# EAGLE board 0.1 (EAGLE 9.2.2), part 1 of 2
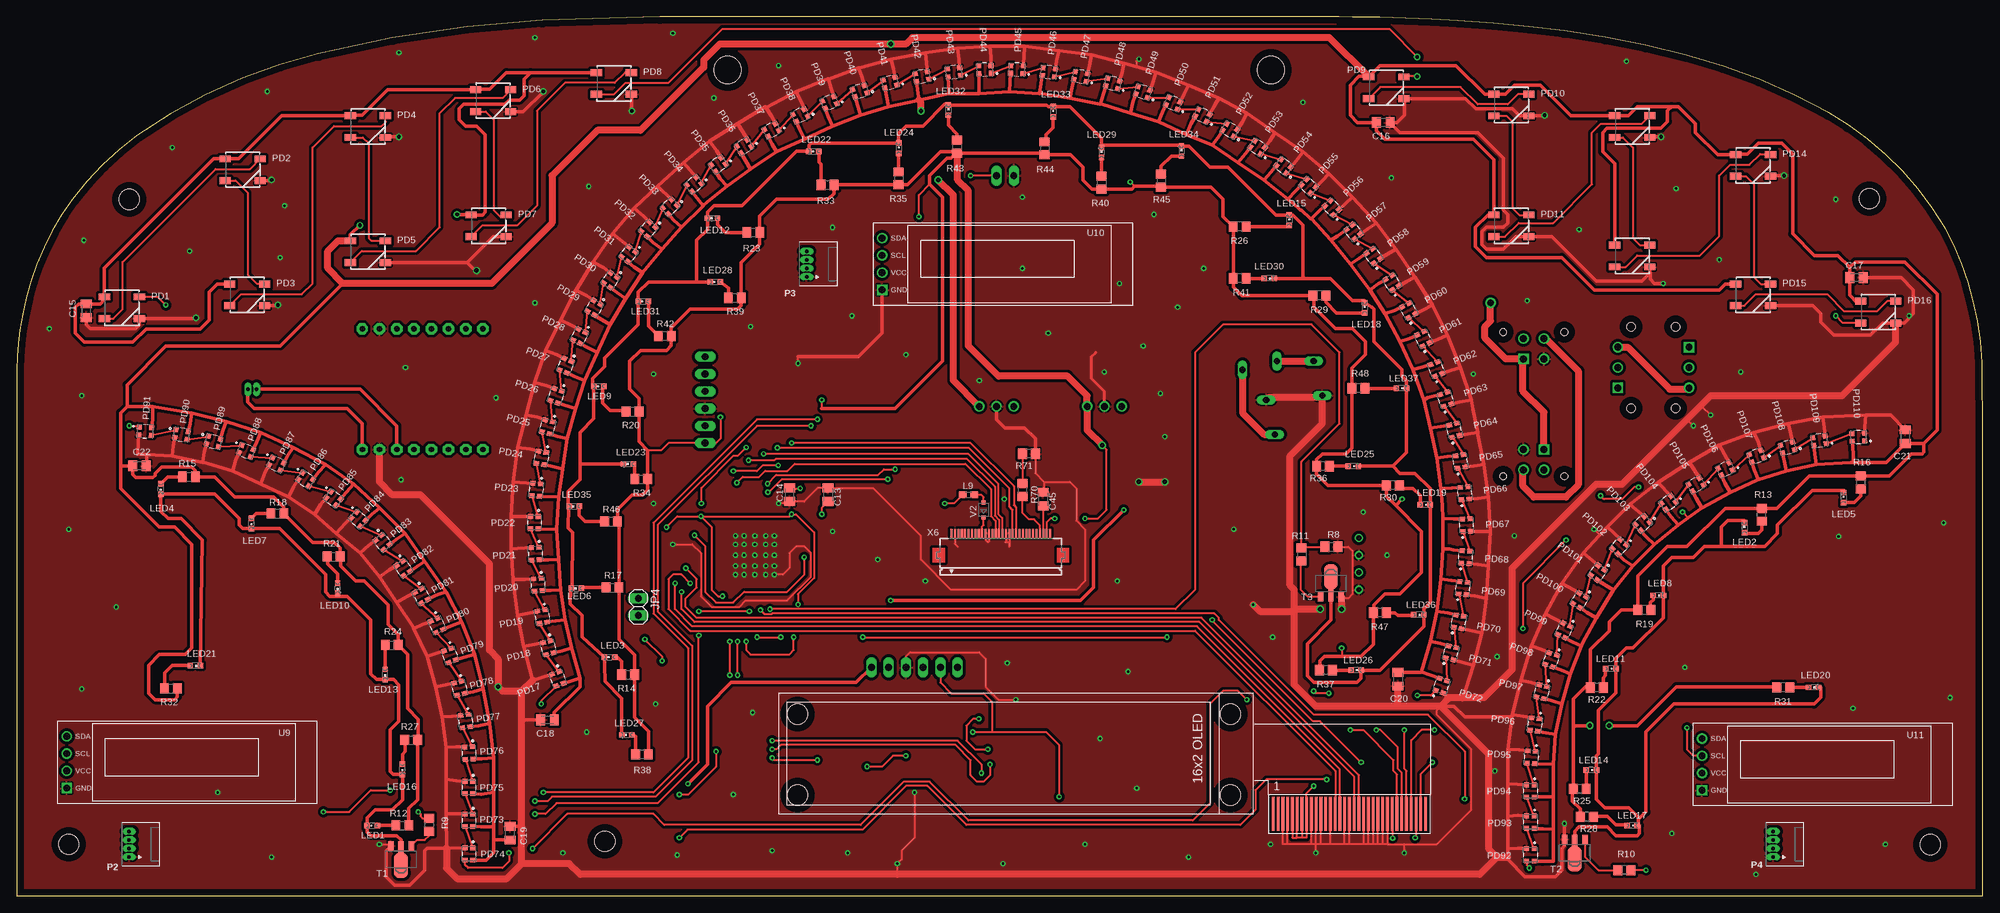
[diagram p9: board, top side]
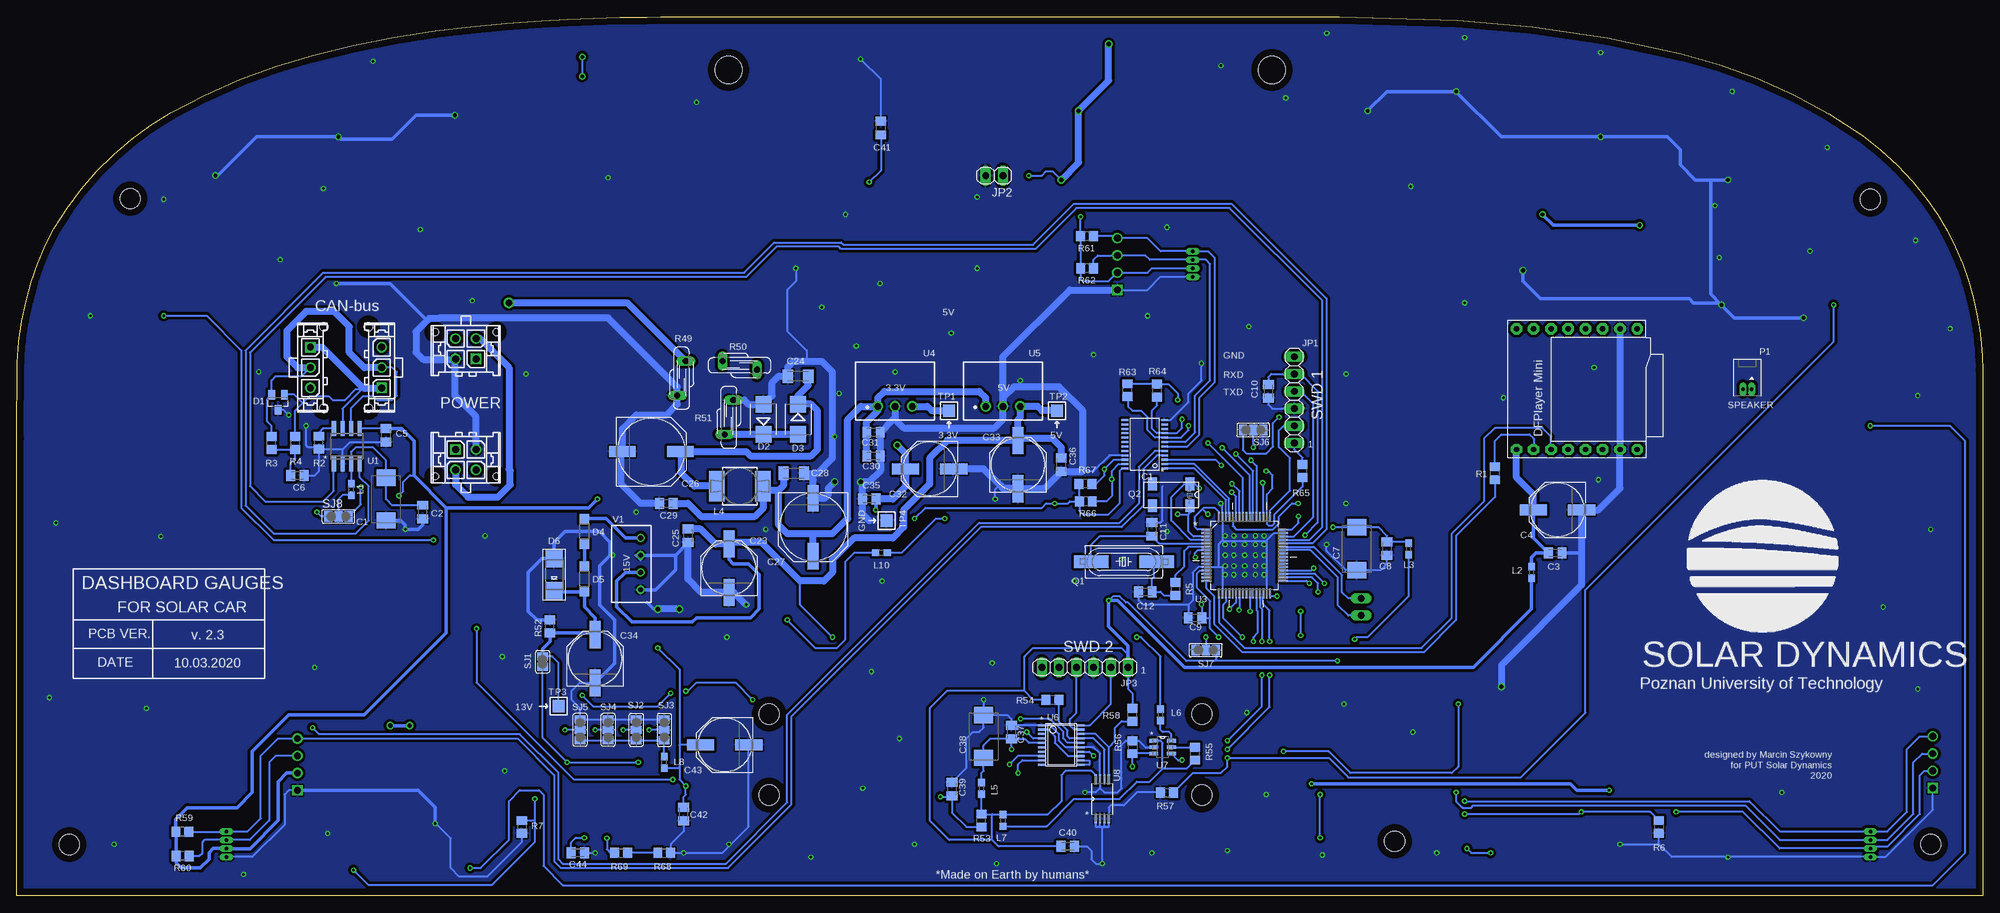
[diagram p10: board, bottom side, seen from below]

Size 289.24 x 129.39 mm. Coordinates in mm from the lower left corner, seen from the top.
Outline: 2.03,90.42 arc9 0.41,83.28 arc6 0,77.47 0,0 289.24,0 289.24,67.31 289.19,78.54 arc10 287.91,87.58 arc16 283.74,98.34 arc30 266.6,115.28 arc15 245.67,123.78 arc7 227.7,127.34 arc4 212.06,128.87 arc2 200.58,129.33 arc1 194.52,129.39 94.62,129.39 77.31,128.88 arc11 44.35,123.98 arc22 17.65,111.94 arc17 8.16,102.52 arc19 2.03,90.42
Copper layers (1*16): Top 0.035mm / dielectric 1.5mm / Bottom 0.035mm
Design rules "default *": minimum track width 6mil, minimum drill 0.35mm, track to track 6mil, track to pad 6mil, pad to pad 6mil, via to via 8mil, smd to smd 6mil, copper to edge 40mil, drill to drill 6mil, minimum pad ring 10mil, minimum via ring 8mil, stop-mask expansion 1mil, vias tented up to drill 27mil, thermal gap 10mil
Holes 4.01 mm at 184.56,121.59 104.57,121.59
Holes 3 mm at 281.56,7.57 7.59,7.59 272.57,102.67 86.51,8.05 16.54,102.54
tKeepout: 682 lines
tRestrict: area 184.8,9.5 to 207.6,14.6
vRestrict: area 136.5,52.1 to 153,54.6

## Footprints (pad centres in the part's own frame; a part is rotated, then mirrored left to right if it is on the bottom)
SMC_D = smd 2.4 x 2.8: + -3.15,0; - 3.15,0
C0805K = smd 1.3 x 1.6: 1 -1,0; 2 1,0
PANASONIC_F = smd 4 x 1.6: + 3.55,0; - -3.55,0
C1206K = smd 1.5 x 2: 1 -1.5,0; 2 1.5,0
PANASONIC_G = smd 3.9 x 1.6: + 4.25,0; - -4.25,0
SOT23 = smd 1 x 1.4: 1 -0.95,-1.1; 2 0.95,-1.1; 3 0,1.1
SMB = smd 2.4 x 2.4: A 2.2,0; C -2.2,0
SOD123 = smd 1.4 x 1.4: A 1.9,0; C -1.9,0
SMADIODE = smd 2.54 x 2.54: A 2.349,0; C -2.349,0
33PIN_LCD16X2 = smd 0.4 x 5: 1 72.8,0; 2 73.5,0; 3 74.2,0; 4 74.9,0; 5 75.6,0; 6 76.3,0; 7 77,0; 8 77.7,0; 9 78.4,0; 10 79.1,0; 11 79.8,0; 12 80.5,0; 13 81.2,0; 14 81.9,0; 15 82.6,0; 16 83.3,0; 17 84,0; 18 84.7,0; 19 85.4,0; 20 86.1,0; 21 86.8,0; 22 87.5,0; 23 88.2,0; 24 88.9,0; 25 89.6,0; 26 90.3,0; 27 91,0; 28 91.7,0; 29 92.4,0; 30 93.1,0; 31 93.8,0; 32 94.5,0; 33 95.2,0 | hole 3: 2.8,14.7; 2.8,2.8; 66.5,14.7; 66.5,2.8
TSSOP24 = smd 0.305 x 0.991: 1 -3.575,-2.918; 2 -2.925,-2.918; 3 -2.275,-2.918; 4 -1.625,-2.918; 5 -0.975,-2.918; 6 -0.325,-2.918; 7 0.325,-2.918; 8 0.975,-2.918; 9 1.625,-2.918; 10 2.275,-2.918; 11 2.925,-2.918; 12 3.575,-2.918; 13 3.575,2.918; 14 2.925,2.918; 15 2.275,2.918; 16 1.625,2.918; 17 0.975,2.918; 18 0.325,2.918; 19 -0.325,2.918; 20 -0.975,2.918; 21 -1.625,2.918; 22 -2.275,2.918; 23 -2.925,2.918; 24 -3.575,2.918
1X06 = drill 1.016 long: 1 -6.35,0; 2 -3.81,0; 3 -1.27,0; 4 1.27,0; 5 3.81,0; 6 6.35,0
1X02 = drill 1.016 long: 1 -1.27,0; 2 1.27,0
L1608 = smd 1.1 x 1: 1 -0.85,0; 2 0.85,0
MS85 = smd 4.5 x 2.25: 1 0,-3.383; 2 0,3.383
CHIPLED_0603 = smd 0.8 x 0.8: A 0,-0.75; C 0,0.75
53048-0210 = drill 0.508 long: 1 -0.635,0; 2 0.635,0
53048-0410 = drill 0.508 long: 1 -1.875,0; 2 -0.625,0; 3 0.625,0; 4 1.875,0
5050 = smd 1.651 x 1: 1 -2.577,1.6; 2 -2.577,-1.6; 3 2.577,-1.6; 4 2.577,1.6
LED_WS2812-2020 = smd 0.7 x 0.7: 1 -0.55,-0.915; 2 0.55,-0.915; 3 0.55,0.915; 4 -0.55,0.915
SM49 = smd 5.08 x 1.778: 1 -4.826,0; 2 4.826,0
SMD4_270 = smd 1.3 x 1.9: 1 -2.75,-1.6; 2 2.75,-1.6; 3 2.75,1.6; 4 -2.75,1.6
R0805 = smd 1.3 x 1.5: 1 -0.95,0; 2 0.95,0
S07K11 = drill 0.914 long: 1 -0.635,-2.54; 2 0.635,2.54
SJ = smd 1.168 x 1.6: 1 -0.762,0; 2 0.762,0
SJ_2 = smd 1.168 x 1.6: 1 -1.524,0; 2 0,0; 3 1.524,0
SOT89-BCE = smd 0.8 x 1.4: B -1.499,-1.981; E 1.499,-1.981 | smd 0.8 x 1.9: C 0,-1.727 | smd 2.032 x 3.65: C@1 0,0.94
TP18SQ = smd 1.8 x 1.8: TP 0,0
SO8 = smd 2.2 x 0.6: 1 -2.6,1.905; 2 -2.6,0.635; 3 -2.6,-0.635; 4 -2.6,-1.905; 5 2.6,-1.905; 6 2.6,-0.635; 7 2.6,0.635; 8 2.6,1.905
DFPLAYER = drill 0.8 pad 1.676 octagon: ADKEY1 8.89,-1.27; ADKEY2 8.89,1.27; BUSY 8.89,8.89; DAC_L -8.89,-1.27; DAC_R -8.89,1.27; GND_1 -8.89,-6.35; GND_2 8.89,-6.35; IO1 8.89,-8.89; IO2 8.89,-3.81; RX -8.89,6.35; SPK1 -8.89,-3.81; SPK2 -8.89,-8.89; TX -8.89,3.81; USB+ 8.89,3.81; USB- 8.89,6.35; VCC -8.89,8.89
QFP50P1200X1200X160-64N = smd 1.473 x 0.279: 1 -5.613,3.759; 2 -5.613,3.251; 3 -5.613,2.743; 4 -5.613,2.261; 5 -5.613,1.753; 6 -5.613,1.245; 7 -5.613,0.762; 8 -5.613,0.254; 9 -5.613,-0.254; 10 -5.613,-0.762; 11 -5.613,-1.245; 12 -5.613,-1.753; 13 -5.613,-2.261; 14 -5.613,-2.743; 15 -5.613,-3.251; 16 -5.613,-3.759; 33 5.613,-3.759; 34 5.613,-3.251; 35 5.613,-2.743; 36 5.613,-2.261; 37 5.613,-1.753; 38 5.613,-1.245; 39 5.613,-0.762; 40 5.613,-0.254; 41 5.613,0.254; 42 5.613,0.762; 43 5.613,1.245; 44 5.613,1.753; 45 5.613,2.261; 46 5.613,2.743; 47 5.613,3.251; 48 5.613,3.759 | smd 0.279 x 1.473: 17 -3.759,-5.613; 18 -3.251,-5.613; 19 -2.743,-5.613; 20 -2.261,-5.613; 21 -1.753,-5.613; 22 -1.245,-5.613; 23 -0.762,-5.613; 24 -0.254,-5.613; 25 0.254,-5.613; 26 0.762,-5.613; 27 1.245,-5.613; 28 1.753,-5.613; 29 2.261,-5.613; 30 2.743,-5.613; 31 3.251,-5.613; 32 3.759,-5.613; 49 3.759,5.613; 50 3.251,5.613; 51 2.743,5.613; 52 2.261,5.613; 53 1.753,5.613; 54 1.245,5.613; 55 0.762,5.613; 56 0.254,5.613; 57 -0.254,5.613; 58 -0.762,5.613; 59 -1.245,5.613; 60 -1.753,5.613; 61 -2.261,5.613; 62 -2.743,5.613; 63 -3.251,5.613; 64 -3.759,5.613
FDSM-173XXXX42 = drill 1: 1 -2.54,0; 2 0,0; 3 2.54,0
TSSOP-20 = smd 0.305 x 0.991: 1 -2.925,-2.918; 2 -2.275,-2.918; 3 -1.625,-2.918; 4 -0.975,-2.918; 5 -0.325,-2.918; 6 0.325,-2.918; 7 0.975,-2.918; 8 1.625,-2.918; 9 2.275,-2.918; 10 2.925,-2.918; 11 2.925,2.918; 12 2.275,2.918; 13 1.625,2.918; 14 0.975,2.918; 15 0.325,2.918; 16 -0.325,2.918; 17 -0.975,2.918; 18 -1.625,2.918; 19 -2.275,2.918; 20 -2.925,2.918
SOT95P280X145-6N = smd 1.27 x 0.559: 1 -1.295,0.94; 2 -1.295,0; 3 -1.295,-0.94; 4 1.295,-0.94; 5 1.295,0; 6 1.295,0.94
SOP65P638X110-8N = smd 1.422 x 0.356: 1 -2.896,0.965; 2 -2.896,0.33; 3 -2.896,-0.33; 4 -2.896,-0.965; 5 2.896,-0.965; 6 2.896,-0.33; 7 2.896,0.33; 8 2.896,0.965
DISPLAY-OLED-128X32 = drill 1 square: 1 -17.78,-3.81 | drill 1: 2 -17.78,-1.27; 3 -17.78,1.27; 4 -17.78,3.81
TME = drill 0.7 pad 1.1: 1 -3.81,0; 2 -1.27,0; 3 1.27,0; 4 3.81,0
SOD323-R = smd 0.6 x 0.6: A 1.1,0; C -1.1,0
43650-0315 = drill 1.02 square: P$1 3,0 | drill 1.02: P$2 0,0; P$3 -3,0 | hole 1.27: 6,-1.96; -6,-1.96
43045-0412 = drill 1.02 square: P$1 1.5,0 | drill 1.02: P$2 -1.5,0; P$3 1.5,3; P$4 -1.5,3 | hole 1.02: 4.5,3.94; -4.5,3.94
FH12-30S-0.5SH = smd 0.3 x 1.3: 1 -7.25,3.25; 2 -6.75,3.25; 3 -6.25,3.25; 4 -5.75,3.25; 5 -5.25,3.25; 6 -4.75,3.25; 7 -4.25,3.25; 8 -3.75,3.25; 9 -3.25,3.25; 10 -2.75,3.25; 11 -2.25,3.25; 12 -1.75,3.25; 13 -1.25,3.25; 14 -0.75,3.25; 15 -0.25,3.25; 16 0.25,3.25; 17 0.75,3.25; 18 1.25,3.25; 19 1.75,3.25; 20 2.25,3.25; 21 2.75,3.25; 22 3.25,3.25; 23 3.75,3.25; 24 4.25,3.25; 25 4.75,3.25; 26 5.25,3.25; 27 5.75,3.25; 28 6.25,3.25; 29 6.75,3.25; 30 7.25,3.25

## Placement (x,y rotation side)
C1  22uF / 35V  [SMC_D]  234.95,58.42 270 bottom
C2  100nF  [C0805K]  229.55,56.51 90 bottom
C3  100nF  [C0805K]  62.86,50.48 180 bottom
C4  100uF / 50V  [PANASONIC_F]  62.55,56.83 180 bottom
C5  100nF  [C0805K]  234.95,67.82 90 bottom
C6  4.7nF  [C0805K]  247.97,61.91 0 bottom
C7  22uF / 35V  [SMC_D]  92.07,51.12 270 bottom
C8  100nF  [C0805K]  87.63,51.12 270 bottom
C9  100nF  [C0805K]  115.89,40.96 180 bottom
C10  100nF  [C0805K]  105.09,74.29 90 bottom
C11  22pF  [C0805K]  122.24,53.98 270 bottom
C12  22pF  [C0805K]  123.19,44.77 0 bottom
C13  6.8pF  [C0805K]  119.38,59.05 270 top
C14  6.8pF  [C0805K]  113.66,59.05 90 top
C15  100nF  [C0805K]  10.21,86.16 90 top
C16  100nF  [C0805K]  201.07,113.87 180 top
C17  100nF  [C0805K]  270.71,91.03 180 top
C18  100nF  [C0805K]  78.07,25.93 180 top
C19  100nF  [C0805K]  72.54,9.25 90 top
C20  100nF  [C0805K]  203.24,31.9 270 top
C21  100nF  [C0805K]  277.9,67.63 90 top
C22  100nF  [C0805K]  18.02,63.33 0 top
C23  100uF / 50V  [PANASONIC_F]  184.47,48.26 90 bottom
C24  100nF  [C1206K]  174.31,76.52 180 bottom
C25  100nF  [C0805K]  190.5,53.02 90 bottom
C26  220uF / 50V  [PANASONIC_G]  195.9,65.41 0 bottom
C27  220uF / 50V  [PANASONIC_G]  172.09,54.29 270 bottom
C28  100nF  [C1206K]  174.94,62.23 0 bottom
C29  100nF  [C0805K]  193.67,57.79 0 bottom
C30  100nF  [C0805K]  163.19,64.77 180 bottom
C31  100nF  [C0805K]  163.19,68.26 180 bottom
C32  100uF / 50V  [PANASONIC_F]  154.94,62.87 180 bottom
C33  100uF / 50V  [PANASONIC_F]  141.92,63.5 90 bottom
C34  100uF / 50V  [PANASONIC_F]  204.15,34.92 90 bottom
C35  100nF  [C0805K]  163.83,58.42 0 bottom
C36  100nF  [C0805K]  135.57,63.5 90 bottom
C37  100nF  [C0805K]  142.87,24.13 270 bottom
C38  22uF / 35V  [SMC_D]  147,23.49 90 bottom
C39  100nF  [C0805K]  151.64,15.75 270 bottom
C40  100nF  [C0805K]  134.62,7.3 0 bottom
C41  100nF  [C0805K]  162.13,113.04 90 bottom
C42  100nF  [C0805K]  191.13,12.06 270 bottom
C43  100uF / 50V  [PANASONIC_F]  185.1,22.22 180 bottom
C44  1u  [C0805K]  206.69,6.35 180 bottom
C45  1u  [C0805K]  151.02,58.43 270 top
D1  PESD1CAN  [SOT23]  250.82,72.71 180 bottom
D2  SM6T27AY  [SMB]  179.39,70.17 90 bottom
D3  SM6T27AY  [SMB]  174.31,70.17 270 bottom
D4  [SOD123]  205.74,53.66 90 bottom
D5  [SOD123]  205.74,46.67 90 bottom
D6  SMAJ15A-TR  [SMADIODE]  210.18,47.31 90 bottom
DISPLAY1  REX001602CYPP5N0  [33PIN_LCD16X2]  112.08,12.06 0 top
IC1  TCA9548A  [TSSOP24]  123.27,66.5 90 bottom
JP1  [1X06]  101.28,73.03 90 bottom
JP2  [1X02]  145.41,106.04 180 bottom
JP3  [1X06]  132.08,33.65 180 bottom
JP4  [1X02]  91.44,42.54 270 top
L1  BLM18PG600  [L1608]  240.04,59.83 270 bottom
L2  BLM18PG600  [L1608]  66.36,47.62 270 bottom
L3  BLM18PG600  [L1608]  84.45,51.12 270 bottom
L4  FERROCORE HPI0530-100  [MS85]  182.88,60.32 270 bottom
L5  BLM18PG600  [L1608]  147.32,15.88 90 bottom
L6  BLM18PG600  [L1608]  120.97,26.67 270 bottom
L7  BLM18PG600  [L1608]  144.15,11.11 270 bottom
L8  BLM18PG600  [L1608]  193.99,19.68 90 bottom
L9  BLM18PG600  [L1608]  140.02,59.05 0 top
L10  BLM18PG600  [L1608]  162.05,50.55 0 bottom
LED1  [CHIPLED_0603]  52.27,10.39 90 top
LED2  [CHIPLED_0603]  254.2,54.2 0 top
LED3  [CHIPLED_0603]  87.2,35.15 90 top
LED4  [CHIPLED_0603]  21.16,59.92 180 top
LED5  [CHIPLED_0603]  268.81,58.65 0 top
LED6  [CHIPLED_0603]  82.32,45.29 90 top
LED7  [CHIPLED_0603]  34.49,54.84 180 top
LED8  [CHIPLED_0603]  241.53,44.25 270 top
LED9  [CHIPLED_0603]  85.64,75.04 90 top
LED10  [CHIPLED_0603]  47.19,45.31 180 top
LED11  [CHIPLED_0603]  234.54,33.45 270 top
LED12  [CHIPLED_0603]  102.35,99.78 90 top
LED13  [CHIPLED_0603]  54.18,32.61 180 top
LED14  [CHIPLED_0603]  231.69,18.53 270 top
LED15  [CHIPLED_0603]  187.24,99.49 0 top
LED16  [CHIPLED_0603]  56.72,18.64 180 top
LED17  [CHIPLED_0603]  237.69,10.39 270 top
LED18  [CHIPLED_0603]  198.32,86.59 0 top
LED19  [CHIPLED_0603]  207.24,57.58 270 top
LED20  [CHIPLED_0603]  264.36,30.71 270 top
LED21  [CHIPLED_0603]  26.24,33.88 270 top
LED22  [CHIPLED_0603]  117.27,109.63 90 top
LED23  [CHIPLED_0603]  89.97,63.59 90 top
LED24  [CHIPLED_0603]  129.74,110.08 0 top
LED25  [CHIPLED_0603]  196.65,63.27 270 top
LED26  [CHIPLED_0603]  197.05,33.25 270 top
LED27  [CHIPLED_0603]  89.74,23.72 90 top
LED28  [CHIPLED_0603]  102.76,90.4 90 top
LED29  [CHIPLED_0603]  159.59,109.45 0 top
LED30  [CHIPLED_0603]  184.26,90.89 270 top
LED31  [CHIPLED_0603]  92.16,87.52 90 top
LED32  [CHIPLED_0603]  137.07,115.68 0 top
LED33  [CHIPLED_0603]  152.49,115.46 0 top
LED34  [CHIPLED_0603]  171.36,109.65 0 top
LED35  [CHIPLED_0603]  82,57.35 90 top
LED36  [CHIPLED_0603]  206.29,41.39 270 top
LED37  [CHIPLED_0603]  203.75,74.73 270 top
P1  53048-0210  [53048-0210]  34.61,74.61 180 bottom
P2  53048-0410  [53048-0410]  16.51,7.62 90 top
P3  53048-0410  [53048-0410]  116.21,93.03 90 top
P4  53048-0410  [53048-0410]  258.44,7.62 90 top
PD1  WS2812B  [5050]  15.44,86.59 0 top
PD2  WS2812B  [5050]  33.22,106.91 0 top
PD3  WS2812B  [5050]  33.86,88.49 0 top
PD4  WS2812B  [5050]  51.64,113.26 0 top
PD5  WS2812B  [5050]  51.64,94.84 0 top
PD6  WS2812B  [5050]  70.05,117.07 0 top
PD7  WS2812B  [5050]  69.42,98.65 0 top
PD8  WS2812B  [5050]  87.83,119.61 0 top
PD9  WS2812B  [5050]  201.5,118.97 0 top
PD10  WS2812B  [5050]  219.91,116.43 0 top
PD11  WS2812B  [5050]  219.91,98.65 0 top
PD12  WS2812B  [5050]  237.69,113.26 0 top
PD13  WS2812B  [5050]  237.69,94.21 0 top
PD14  WS2812B  [5050]  255.47,107.54 0 top
PD15  WS2812B  [5050]  255.47,88.49 0 top
PD16  WS2812B  [5050]  273.89,85.95 0 top
PD17  WS2812B2020  [LED_WS2812-2020]  79.58,31.98 200 top
PD18  WS2812B2020  [LED_WS2812-2020]  78.18,36.55 194 top
PD19  WS2812B2020  [LED_WS2812-2020]  77.29,41.12 190 top
PD20  WS2812B2020  [LED_WS2812-2020]  76.66,45.82 185 top
PD21  WS2812B2020  [LED_WS2812-2020]  76.28,50.39 182 top
PD22  WS2812B2020  [LED_WS2812-2020]  76.15,54.97 180 top
PD23  WS2812B2020  [LED_WS2812-2020]  76.4,59.79 175 top
PD24  WS2812B2020  [LED_WS2812-2020]  77.17,64.49 170 top
PD25  WS2812B2020  [LED_WS2812-2020]  78.05,69.06 165 top
PD26  WS2812B2020  [LED_WS2812-2020]  79.32,73.63 162 top
PD27  WS2812B2020  [LED_WS2812-2020]  80.72,78.08 158 top
PD28  WS2812B2020  [LED_WS2812-2020]  82.75,82.4 154 top
PD29  WS2812B2020  [LED_WS2812-2020]  84.91,86.59 150 top
PD30  WS2812B2020  [LED_WS2812-2020]  87.33,90.65 146 top
PD31  WS2812B2020  [LED_WS2812-2020]  89.99,94.46 142 top
PD32  WS2812B2020  [LED_WS2812-2020]  92.91,98.15 138 top
PD33  WS2812B2020  [LED_WS2812-2020]  96.09,101.45 134 top
PD34  WS2812B2020  [LED_WS2812-2020]  99.64,104.75 130 top
PD35  WS2812B2020  [LED_WS2812-2020]  103.2,107.67 126 top
PD36  WS2812B2020  [LED_WS2812-2020]  107.01,110.34 123 top
PD37  WS2812B2020  [LED_WS2812-2020]  111.07,112.75 119 top
PD38  WS2812B2020  [LED_WS2812-2020]  115.27,114.91 115 top
PD39  WS2812B2020  [LED_WS2812-2020]  119.58,116.81 112 top
PD40  WS2812B2020  [LED_WS2812-2020]  124.03,118.47 108 top
PD41  WS2812B2020  [LED_WS2812-2020]  128.47,119.74 104 top
PD42  WS2812B2020  [LED_WS2812-2020]  133.17,120.62 100 top
PD43  WS2812B2020  [LED_WS2812-2020]  137.87,121.26 96 top
PD44  WS2812B2020  [LED_WS2812-2020]  142.44,121.64 92 top
PD45  WS2812B2020  [LED_WS2812-2020]  147.14,121.64 88 top
PD46  WS2812B2020  [LED_WS2812-2020]  151.84,121.26 84 top
PD47  WS2812B2020  [LED_WS2812-2020]  156.54,120.62 80 top
PD48  WS2812B2020  [LED_WS2812-2020]  161.24,119.61 76 top
PD49  WS2812B2020  [LED_WS2812-2020]  165.68,118.34 72 top
PD50  WS2812B2020  [LED_WS2812-2020]  170.13,116.69 68 top
PD51  WS2812B2020  [LED_WS2812-2020]  174.45,114.91 64 top
PD52  WS2812B2020  [LED_WS2812-2020]  178.51,112.75 60 top
PD53  WS2812B2020  [LED_WS2812-2020]  182.58,110.21 56 top
PD54  WS2812B2020  [LED_WS2812-2020]  186.39,107.42 52 top
PD55  WS2812B2020  [LED_WS2812-2020]  190.07,104.5 48 top
PD56  WS2812B2020  [LED_WS2812-2020]  193.5,101.32 44 top
PD57  WS2812B2020  [LED_WS2812-2020]  196.67,97.76 40 top
PD58  WS2812B2020  [LED_WS2812-2020]  199.59,94.21 36 top
PD59  WS2812B2020  [LED_WS2812-2020]  202.39,90.27 32 top
PD60  WS2812B2020  [LED_WS2812-2020]  204.8,86.21 29 top
PD61  WS2812B2020  [LED_WS2812-2020]  206.96,82.02 26 top
PD62  WS2812B2020  [LED_WS2812-2020]  208.86,77.57 21 top
PD63  WS2812B2020  [LED_WS2812-2020]  210.26,73.13 17 top
PD64  WS2812B2020  [LED_WS2812-2020]  211.53,68.55 13 top
PD65  WS2812B2020  [LED_WS2812-2020]  212.42,63.98 9 top
PD66  WS2812B2020  [LED_WS2812-2020]  213.06,59.28 6 top
PD67  WS2812B2020  [LED_WS2812-2020]  213.31,54.58 2 top
PD68  WS2812B2020  [LED_WS2812-2020]  213.18,49.89 357 top
PD69  WS2812B2020  [LED_WS2812-2020]  212.8,45.31 354 top
PD70  WS2812B2020  [LED_WS2812-2020]  212.17,40.36 350 top
PD71  WS2812B2020  [LED_WS2812-2020]  211.02,35.79 346 top
PD72  WS2812B2020  [LED_WS2812-2020]  209.63,30.96 342 top
PD73  WS2812B2020  [LED_WS2812-2020]  66.5,6.2 180 top
PD74  WS2812B2020  [LED_WS2812-2020]  66.5,11.15 180 top
PD75  WS2812B2020  [LED_WS2812-2020]  66.5,15.98 180 top
PD76  WS2812B2020  [LED_WS2812-2020]  66.5,21.06 183 top
PD77  WS2812B2020  [LED_WS2812-2020]  65.99,25.76 188 top
PD78  WS2812B2020  [LED_WS2812-2020]  65.1,30.58 194 top
PD79  WS2812B2020  [LED_WS2812-2020]  63.7,35.41 200 top
PD80  WS2812B2020  [LED_WS2812-2020]  61.8,39.85 205 top
PD81  WS2812B2020  [LED_WS2812-2020]  59.51,44.17 210 top
PD82  WS2812B2020  [LED_WS2812-2020]  56.85,48.23 215 top
PD83  WS2812B2020  [LED_WS2812-2020]  53.8,52.04 220 top
PD84  WS2812B2020  [LED_WS2812-2020]  50.24,55.47 227 top
PD85  WS2812B2020  [LED_WS2812-2020]  46.56,58.52 233 top
PD86  WS2812B2020  [LED_WS2812-2020]  42.49,61.32 237 top
PD87  WS2812B2020  [LED_WS2812-2020]  38.18,63.6 244 top
PD88  WS2812B2020  [LED_WS2812-2020]  33.73,65.51 249 top
PD89  WS2812B2020  [LED_WS2812-2020]  28.91,66.9 256 top
PD90  WS2812B2020  [LED_WS2812-2020]  24.21,67.92 261 top
PD91  WS2812B2020  [LED_WS2812-2020]  18.87,68.43 267 top
PD92  WS2812B2020  [LED_WS2812-2020]  222.71,6.07 180 top
PD93  WS2812B2020  [LED_WS2812-2020]  222.71,10.9 180 top
PD94  WS2812B2020  [LED_WS2812-2020]  222.71,15.47 180 top
PD95  WS2812B2020  [LED_WS2812-2020]  222.83,20.42 176 top
PD96  WS2812B2020  [LED_WS2812-2020]  223.34,25.25 172 top
PD97  WS2812B2020  [LED_WS2812-2020]  224.36,30.07 167 top
PD98  WS2812B2020  [LED_WS2812-2020]  225.76,34.77 161 top
PD99  WS2812B2020  [LED_WS2812-2020]  227.66,39.09 155 top
PD100  WS2812B2020  [LED_WS2812-2020]  229.95,43.54 150 top
PD101  WS2812B2020  [LED_WS2812-2020]  232.61,47.6 144 top
PD102  WS2812B2020  [LED_WS2812-2020]  235.79,51.41 138 top
PD103  WS2812B2020  [LED_WS2812-2020]  239.22,54.84 133 top
PD104  WS2812B2020  [LED_WS2812-2020]  243.03,57.89 128 top
PD105  WS2812B2020  [LED_WS2812-2020]  247.09,60.55 120 top
PD106  WS2812B2020  [LED_WS2812-2020]  251.41,62.84 116 top
PD107  WS2812B2020  [LED_WS2812-2020]  255.98,64.74 110 top
PD108  WS2812B2020  [LED_WS2812-2020]  260.55,66.01 105 top
PD109  WS2812B2020  [LED_WS2812-2020]  265.25,67.03 98 top
PD110  WS2812B2020  [LED_WS2812-2020]  270.97,67.54 92 top
Q1  16MHz  [SM49]  126.36,49.21 0 bottom
Q2  32.768kHz  [SMD4_270]  119.38,59.05 180 bottom
R1  1k  [R0805]  71.75,62.23 90 bottom
R2  0  [R0805]  244.81,66.73 90 bottom
R3  60  [R0805]  251.78,66.67 90 bottom
R4  60  [R0805]  248.28,66.67 90 bottom
R5  100  [R0805]  118.74,45.21 90 bottom
R6  1M  [R0805]  47.62,10.16 270 bottom
R7  1M  [R0805]  214.95,10.16 270 bottom
R8  1M  [R0805]  193.43,51.41 0 top
R9  1k  [R0805]  60.64,10.48 270 top
R10  1k  [R0805]  236.54,3.81 180 top
R11  1k  [R0805]  189.03,50.27 270 top
R12  120  [R0805]  56.72,10.39 0 top
R13  120  [R0805]  256.74,56.11 90 top
R14  30  [R0805]  89.94,32.59 0 top
R15  120  [R0805]  25.31,61.71 0 top
R16  120  [R0805]  271.35,60.87 90 top
R17  30  [R0805]  87.63,45.4 0 top
R18  120  [R0805]  38.33,56.31 0 top
R19  120  [R0805]  239.48,42.11 180 top
R20  30  [R0805]  90.58,71.32 0 top
R21  120  [R0805]  46.58,49.96 0 top
R22  120  [R0805]  232.5,30.68 180 top
R23  30  [R0805]  108.36,97.68 0 top
R24  120  [R0805]  55.16,36.94 0 top
R25  120  [R0805]  229.96,15.76 180 top
R26  30  [R0805]  179.93,98.54 180 top
R27  120  [R0805]  58.01,22.97 0 top
R28  120  [R0805]  231.03,11.66 180 top
R29  30  [R0805]  191.68,88.38 180 top
R30  30  [R0805]  202.48,60.44 180 top
R31  120  [R0805]  259.92,30.71 180 top
R32  120  [R0805]  22.66,30.57 0 top
R33  30  [R0805]  119.27,104.69 0 top
R34  30  [R0805]  91.87,61.37 0 top
R35  30  [R0805]  129.74,105.64 270 top
R36  30  [R0805]  192.2,63.27 180 top
R37  30  [R0805]  192.61,33.25 180 top
R38  30  [R0805]  91.96,20.87 0 top
R39  30  [R0805]  105.64,88.06 0 top
R40  30  [R0805]  159.59,105 270 top
R41  30  [R0805]  179.93,90.92 180 top
R42  30  [R0805]  95.34,82.44 0 top
R43  30  [R0805]  138.34,110.29 270 top
R44  30  [R0805]  151.22,110.06 270 top
R45  30  [R0805]  168.36,105.3 270 top
R46  30  [R0805]  87.4,55.13 0 top
R47  30  [R0805]  200.57,41.71 180 top
R48  30  [R0805]  197.4,74.73 180 top
R49  VAR7-30  [S07K11]  191.45,76.2 180 bottom
R50  ECE RB300-30  [S07K11]  182.88,78.1 90 bottom
R51  VAR7-30  [S07K11]  184.47,70.48 0 bottom
R52  100  [R0805]  210.82,39.69 90 bottom
R53  10k  [R0805]  147.32,11.11 90 bottom
R54  1k  [R0805]  136.84,28.89 0 bottom
R55  1k  [R0805]  115.89,20.95 90 bottom
R56  10k  [R0805]  125.09,21.91 270 bottom
R57  10k  [R0805]  120.02,15.24 0 bottom
R58  1k  [R0805]  125.09,26.67 90 bottom
R59  1k  [R0805]  264.91,9.45 180 bottom
R60  1k  [R0805]  264.85,5.89 180 bottom
R61  1k  [R0805]  131.79,97.12 180 bottom
R62  1k  [R0805]  131.76,92.39 180 bottom
R63  1k  [R0805]  125.82,74.46 90 bottom
R64  1k  [R0805]  121.48,74.41 90 bottom
R65  1k  [R0805]  100.08,62.55 90 bottom
R66  1k  [R0805]  131.95,58.08 180 bottom
R67  1k  [R0805]  132.02,60.67 180 bottom
R68  0  [R0805]  193.99,6.35 0 bottom
R69  390k  [R0805]  200.34,6.35 0 bottom
R70  390k  [R0805]  147.96,59.75 270 top
R71  0  [R0805]  148.91,65.09 180 top
SJ1  [SJ]  211.9,34.48 270 bottom
SJ2  [SJ_2]  198.12,24.45 270 bottom
SJ3  [SJ_2]  193.99,24.45 270 bottom
SJ4  [SJ_2]  202.25,24.45 90 bottom
SJ5  [SJ_2]  206.37,24.45 90 bottom
SJ6  [SJ_2]  107.31,68.58 180 bottom
SJ7  [SJ_2]  114.3,36.2 0 bottom
SJ8  [SJ_2]  241.93,55.88 0 bottom
T1  SOT89 NPN BCE  [SOT89-BCE]  56.51,5.4 180 top
T2  SOT89 NPN BCE  [SOT89-BCE]  229.23,6.35 180 top
T3  SOT89 NPN BCE  [SOT89-BCE]  193.36,46.04 0 top
TP1  3V3  [TP18SQ]  152.08,71.44 0 bottom
TP2  5V  [TP18SQ]  136.21,71.44 0 bottom
TP3  12V  [TP18SQ]  209.55,27.94 0 bottom
TP4  GND  [TP18SQ]  161.29,55.24 0 bottom
U1  TLE7251VSO8  [SO8]  240.7,66.19 90 bottom
U2  DFPLAYER  [DFPLAYER]  59.69,74.61 90 bottom
U3  STM32F103RET6  [QFP50P1200X1200X160-64N]  108.59,50.16 0 bottom
U4  3.3V  [FDSM-173XXXX42]  160.02,72.07 0 bottom
U5  5V  [FDSM-173XXXX42]  144.15,72.07 0 bottom
U6  STM32F030XTSSOP20  [TSSOP-20]  135.57,22.22 270 bottom
U7  SN74LVC1T45DBVT  [SOT95P280X145-6N]  120.65,21.91 0 bottom
U8  24LC64-I/ST  [SOP65P638X110-8N]  129.54,14.29 90 bottom
U9  DISPLAY-OLED-128X32  [DISPLAY-OLED-128X32]  25.08,19.68 0 top
U10  DISPLAY-OLED-128X32  [DISPLAY-OLED-128X32]  145.1,93.03 0 top
U11  DISPLAY-OLED-128X32  [DISPLAY-OLED-128X32]  265.75,19.37 0 top
V1  TME0515S  [TME]  197.48,48.9 90 bottom
V2  BAT60  [SOD323-R]  142.24,56.83 90 top
X1  [43650-0315]  235.59,77.79 270 bottom
X2  [43650-0315]  246.06,77.79 90 bottom
X3  [43045-0412]  223.2,65.72 180 bottom
X4  [43045-0412]  223.2,79.06 0 bottom
X6  FH12-30S-0.5SH  [FH12-30S-0.5SH]  144.78,50.16 0 top

## Tracks (layer width: path | path; a pad name or v marks a point on that pad's centre or on a via)
+3V3  (via drill 0.35, 0.65)
  Top 0.305: v157.16,55.56 159.07,55.56 160.34,56.83 160.34,65.72 v159.7,66.36 | L9.1 137.9,57.79 v136.53,57.79 | DISPLAY1.5 187.68,8.57 188.38,8.57 | 188.38,8.57 DISPLAY1.6 | DISPLAY1.7 189.08,8.57 | 189.08,8.57 188.38,8.57 | 189.08,8.57 189.78,8.57 DISPLAY1.8 189.78,15.15 v190.82,16.19 | v194.94,36.51 194.94,35.24 | v163.83,105.09 164.47,104.46 | v132.72,100.01 132.72,103.19 134.3,104.77 | v118.43,73.03 118.43,71.75 | v45.08,12.38 48.89,12.38 52.07,15.56 v54.93,15.56 | v92.39,37.78 94.93,35.24 v94.93,34.61 | v103.5,70.48 103.5,67.31 102.87,66.67 JP1.1 95.88,66.67 94.82,65.61 92.82,65.61 | v238.63,60.2 238,60.2 236.22,58.42 233.55,58.42 v233.04,58.93
  Top 0.508: R38.2 92.91,24.25 90.89,26.27 R14.2 90.89,35.47 88.58,37.79 R17.2 88.58,54.9 R46.2 88.35,56.92 90.49,59.05 92.07,59.05 92.82,59.8 R34.2 92.82,65.61 91.53,66.91 R20.2 91.53,73.26 90.17,74.61 90.17,78.74 91.76,80.33 95.57,80.33 96.29,81.05 R42.2 96.29,83.59 99.06,86.36 106.04,86.36 106.59,86.9 R39.2 106.59,93.25 109.31,95.97 R23.2 109.31,100.1 111.76,102.55 119.38,102.55 120.22,103.39 R33.2 R35.2 131.04,104.69 135.89,109.54 138.14,109.54 138.28,109.39 | 138.28,109.39 R43.2 138.43,109.34 150.99,109.34 R44.2 155.05,109.11 156.84,107.31 156.84,105.41 158.2,104.05 R40.2 164.06,104.05 164.47,104.46 168.25,104.46 R45.2 175.69,104.35 177.48,102.55 177.48,100.04 R26.2 R41.2 178.98,89.62 180.23,88.38 R29.2 190.82,88.29 190.82,86.68 193.99,83.5 196.53,83.5 198.44,81.6 198.44,79.69 196.45,77.7 R48.2 196.45,65.95 195.58,65.09 192.09,65.09 191.25,64.25 R36.2 191.25,62.11 192.93,60.44 R30.2 201.53,58.82 202.88,57.47 | 202.88,57.47 206.69,53.66 206.69,47.62 203.52,44.45 201.29,44.45 199.71,42.86 199.71,41.79 R47.2 199.62,37.06 197.8,35.24 194.94,35.24 192.41,35.24 191.77,34.61 191.77,33.36 R37.2 | v203.84,58.42 202.88,57.47 | 118.43,71.75 129.22,71.75 136.21,78.74 136.21,102.87 134.3,104.77 134.3,106.04 136.84,108.58 137.48,108.58 138.28,109.39 | v162.88,56.83 158.43,52.39 158.43,45.4 156.53,43.5 v128.59,43.5 | JP3.1 123.51,31.43 105.09,31.43 101.6,27.94 101.6,19.37 v98.74,16.51
  Top 1.016: v159.7,66.36 157.48,68.58 U4.3 157.48,73.66 154.62,76.52 144.46,76.52 140.02,80.96 140.02,103.82 138.43,105.41 138.43,109.34
  Bottom 0.305: v157.16,55.56 155.57,57.15 138.43,57.15 137.79,57.79 v136.53,57.79 134.62,57.79 134.3,58.1 132.93,58.1 R66.2 | v194.94,36.51 191.77,33.34 191.77,22.22 | 191.77,22.22 191.77,19.05 | 191.77,19.05 191.77,17.14 v190.82,16.19 190.82,14.92 191.13,14.6 C42.1 | L8.1 191.98,18.83 191.77,19.05 | C43.+ 191.77,22.22 | P3.2 122.24,92.39 122.87,91.76 U10.2 128.59,90.49 132.4,90.49 132.71,90.8 R62.2 132.74,92.42 R61.2 132.74,99.99 v132.72,100.01 | U9.2 8.57,18.41 9.21,17.78 9.21,12.06 13.97,7.3 16.2,7.3 P2.2 29.85,6.99 35.24,12.38 v45.08,12.38 | 265.84,5.94 R60.2 | 258.46,6.98 P4.2 | IC1.24 126.62,62.92 127,62.55 127,57.79 128.59,56.2 132.4,56.2 132.9,56.7 R66.2 | C5.2 238.77,68.82 U1.5 | L5.1 R53.2 145.73,12.06 | 145.73,12.06 144.24,12.06 L7.1 137.58,11.96 135.57,13.97 135.57,17.78 134.94,18.41 131.13,18.41 130.49,17.78 130.49,17.2 U8.8 | R58.2 125.09,29.84 125.73,30.48 JP3.1 125.73,35.56 126.68,36.51 139.7,36.51 140.97,35.24 140.97,30.16 | R54.1 139.7,28.89 140.97,30.16 | C40.1 144.78,7.3 145.73,8.25 | 145.73,8.25 145.73,12.06 | C41.1 162.13,106.79 v163.83,105.09 | R63.2 125.77,75.36 R64.2 119.81,75.36 118.43,73.98 v118.43,73.03 | R65.2 100.08,64.52 101.28,65.72 JP1.1 | 145.73,8.25 152.08,8.25 154.94,11.11 154.94,27.62 152.4,30.16 140.97,30.16 | R67.2 132.97,58.14 R66.2 | L3.2 84.45,44.13 90.49,38.1 92.07,38.1 v92.39,37.78 | v94.93,34.61 113.03,34.61 | 113.03,34.61 117.16,34.61 125.73,43.18 126.05,43.18 127,44.13 127.95,44.13 v128.59,43.5 | SJ6.3 108.84,65.66 108.33,65.15 105.41,65.15 104.39,66.17 104.39,69.6 v103.5,70.48 | SJ7.3 112.78,34.86 113.03,34.61 | SJ8.3 238.63,57.66 v238.63,60.2
  Bottom 0.305: v233.04,58.93 232.41,59.56 232.41,60.96 231.46,61.91 230.82,61.91
  Bottom 0.508: C5.2 232.65,68.82 230.82,66.99 230.82,61.91 226.06,57.15 | 226.06,57.15 205.1,57.15 v203.84,58.42 | U11.2 249.55,18.1 250.82,16.83 250.82,11.11 254.95,6.98 258.46,6.98 | P4.2 260.34,6.99 260.99,6.35 260.99,5.4 262.25,4.13 265.11,4.13 265.84,4.86 265.84,5.94 | R60.2 265.8,9.38 R59.2 265.86,11.32 264.16,13.02 256.86,13.02 254.63,15.24 254.63,21.27 249.24,26.67 238.12,26.67 226.06,38.73 226.06,57.15 | C35.2 162.83,56.88 v162.88,56.83 | JP3.1 125.73,36.83 128.59,39.69 v128.59,43.5 127.32,43.5 117.47,33.65 74.93,33.65 66.36,42.23 L2.2 | v54.93,15.56 59.69,15.56 60.64,16.51 v98.74,16.51
  Bottom 1.016: v159.7,66.36 158.49,65.15 C32.+ 158.49,60.27 160.34,58.42 C35.2 | U4.3 155.26,72.07 154.62,71.44 TP1.TP
+5V  (via drill 0.35, 0.55, 0.65)
  Top 0.305: v124.46,38.1 v169.23,38.1 | JP2.1 v140.34,106.04 | v245.11,56.51 245.91,55.71 245.91,55.65
  Top 0.508: PD3.1 29.45,90.09 28.26,88.9 28.26,84.77 26.94,83.45 19,83.45 17.06,81.51 9.93,81.51 8.57,82.87 8.57,86.68 9.05,87.16 C15.2 12.23,87.16 12.87,87.8 PD1.1 12.87,92.41 28.97,108.51 PD2.1 32.63,108.51 38.98,114.86 PD4.1 49.14,114.94 50.8,114.94 54.53,118.67 PD6.1 67.55,118.74 69.53,118.74 72,121.21 75.56,121.21 | 75.56,121.21 PD8.1 | 82.87,32.07 82.49,31.95 81.63,31.69 PD17.4 | 82.87,32.07 81.68,36.22 81.6,36.51 | 81.6,36.51 80.19,36.05 PD18.4 | 81.6,36.51 80.64,40.64 | 80.64,40.64 79.26,40.48 PD19.4 | 80.64,40.64 80.01,45.09 | 80.01,45.09 78.56,45.01 PD20.4 | 80.01,45.09 79.69,49.53 | 79.69,49.53 78.14,49.48 PD21.4 | 79.69,49.53 79.38,53.98 | 79.38,53.98 79.69,58.74 | 79.69,58.74 80.32,62.82 | 80.32,62.82 80.33,62.87 78.79,63.21 PD24.4 | 80.32,62.82 80.96,67.31 | 80.96,67.31 79.57,67.65 PD25.4 | 80.96,67.31 82.23,71.75 | 82.23,71.75 83.5,75.88 | 83.5,75.88 82.05,76.49 PD27.4 | 83.5,75.88 85.29,79.75 | 85.29,79.75 85.41,80.01 83.97,80.72 PD28.4 | 85.29,79.75 87.31,84.14 | 87.31,84.14 86.01,84.83 PD29.4 | 87.31,84.14 89.53,87.95 | 89.53,87.95 88.29,88.82 PD30.4 | 89.53,87.95 92.07,91.76 | 92.07,91.76 90.83,92.57 PD31.4 | 92.07,91.76 94.93,95.25 | 94.93,95.25 93.62,96.2 PD32.4 | 94.93,95.25 97.79,98.42 | 97.79,98.42 96.66,99.46 PD33.4 | 97.79,98.42 100.95,101.58 100.95,101.6 | 100.95,101.6 100.07,102.72 PD34.4 | 100.95,101.6 101.6,102.23 104.46,104.46 | 104.46,104.46 103.48,105.62 PD35.4 | 104.46,104.46 107.95,107 | 107.95,107 107.19,108.27 PD36.4 | 107.95,107 111.76,109.54 | 111.76,109.54 111.11,110.68 PD37.4 | 111.76,109.54 115.89,111.44 | 115.89,111.44 115.15,112.84 PD38.4 | 115.89,111.44 120.02,113.35 | 120.02,113.35 119.36,114.75 PD39.4
  Top 0.508: 120.02,113.35 124.14,114.94 | 124.14,114.94 123.66,116.43 PD40.4 | 124.14,114.94 128.27,116.2 | 128.27,116.2 127.97,117.73 PD41.4 | 128.27,116.2 132.41,117.09 | 132.41,117.09 132.72,117.16 132.53,118.66 PD42.4 | 132.41,117.09 132.72,117.16 137.01,118.11 137.16,118.11 | 137.16,118.11 141.6,118.11 141.59,118.11 | 137.16,118.11 137.11,119.33 PD43.4 | 141.59,118.11 141.53,119.46 141.53,119.78 PD44.4 | 141.59,118.11 146.05,118.43 | 146.05,118.43 146.1,119.85 PD45.4 | 146.05,118.43 150.49,118.11 150.5,118.15 | 150.5,118.15 150.68,119.54 PD46.4 | 150.5,118.15 154.94,117.47 | 154.94,117.47 155.26,118.99 PD47.4 | 154.94,117.47 159.38,116.52 159.41,116.61 | 159.41,116.61 159.85,118.07 PD48.4 | 159.41,116.61 163.83,115.25 | 163.83,115.25 164.19,116.9 PD49.4 | 163.83,115.25 167.96,113.98 | 167.96,113.98 168.54,115.36 PD50.4 | 167.96,113.98 172.09,112.08 | 172.09,112.08 172.77,113.69 PD51.4 | 172.09,112.08 175.9,110.49 | 175.9,110.49 176.01,110.64 176.75,111.66 PD52.4 | 175.9,110.49 179.71,107.95 | 179.71,107.95 180.74,109.24 PD53.4 | 179.71,107.95 183.52,105.41 | 183.52,105.41 184.49,106.58 PD54.4 | 183.52,105.41 187.01,102.55 | 187.01,102.55 188.12,103.79 PD55.4 | 187.01,102.55 188.59,101.28 188.9,100.98 189.05,100.98 190.34,99.69 190.5,99.69 | 190.5,99.69 191.51,100.75 PD56.4 | 190.5,99.69 193.36,96.52 | 193.36,96.52 194.32,97.13 PD57.4 | 193.36,96.52 196.22,93.03 | 196.22,93.03 197.54,93.92 PD58.4 | 196.22,93.03 199.07,89.22 | 199.07,89.22 200.32,90.13 PD59.4 | 199.07,89.22 201.29,85.72 | 201.29,85.72 202.73,86.17 PD60.4 | 201.29,85.72 203.52,81.6 | 203.52,81.6 204.89,82.09 PD61.4 | 203.52,81.6 205.42,77.47 | 205.42,77.47 206.81,77.83 PD62.4
  Top 0.508: 205.42,77.47 207.01,73.03 | 207.01,73.03 207.65,73.34 207.93,73.43 PD63.4 | 207.01,73.03 207.96,68.9 | 207.96,68.9 209.53,69.09 PD64.4 | 207.96,68.9 208.91,64.45 | 208.91,64.45 210.46,64.66 PD65.4 | 208.91,64.45 209.55,60.01 209.56,60.01 | 209.56,60.01 211.14,60.06 PD66.4 | 209.56,60.01 209.73,57.48 209.87,55.56 | 209.87,55.56 211.45,55.49 PD67.4 | 209.87,55.56 209.87,51.12 | 209.87,51.12 210.82,51.12 211.41,50.95 PD68.4 | 209.87,51.12 209.55,46.67 | 209.55,46.67 211.09,46.47 PD69.4 | 209.55,46.67 208.91,41.91 | 208.91,41.91 210.54,41.64 PD70.4 | 208.91,41.91 207.96,37.46 | 207.96,37.46 209.49,37.18 PD71.4 | 207.96,37.46 206.69,33.02 | 206.69,33.02 207.91,32.56 PD72.4 | 20,72.07 19.97,71.12 19.94,70.2 PD91.4 | 20,72.07 25.72,71.12 | 25.72,71.12 25.45,69.57 PD90.4 | 25.72,71.12 30.8,69.85 | 30.8,69.85 30.29,68.44 PD89.4 | 30.8,69.85 35.88,68.26 | 35.88,68.26 35.3,66.86 PD88.4 | 35.88,68.26 40.64,66.04 | 40.64,66.04 39.85,64.82 PD87.4 | 40.64,66.04 45.4,63.5 | 45.4,63.5 44.31,62.32 PD86.4 | 45.4,63.5 49.53,60.64 | 49.53,60.64 48.44,59.39 PD85.4 | 49.53,60.64 53.34,57.15 | 53.34,57.15 52.2,56.15 PD84.4 | 53.34,57.15 57.15,53.34 | 57.15,53.34 55.82,52.47 PD83.4 | 57.15,53.34 60.01,49.21 | 60.01,49.21 58.9,48.48 PD82.4 | 60.01,49.21 63.18,44.77 | 63.18,44.77 62.23,44.45 61.58,44.24 PD81.4 | 63.18,44.77 65.41,40.32 | 65.41,40.32 63.87,39.74 PD80.4 | 65.41,40.32 67.31,35.56 | 67.31,35.56 65.75,35.12 PD79.4 | 67.31,35.56 68.58,30.48 | 68.58,30.48 67.11,30.08 PD78.4 | 68.58,30.48 69.53,25.4 | 69.53,25.4 67.93,25.04 PD77.4 | 69.53,25.4 70.17,20.32 | 70.17,20.32 68.37,20.18 PD76.4 | 70.17,20.32 70.17,15.24 | 70.17,15.24 68.32,15 PD75.4 | 70.17,15.24 70.17,10.16
  Top 0.508: 70.17,10.16 68.32,10.18 PD74.4 | 70.17,10.16 70.17,8.25 70.18,8.25 | 226.06,9.84 226.06,5.08 224.53,5.1 223.32,5.1 PD92.4 | 226.06,9.84 224.53,9.92 223.32,9.92 PD93.4 | 226.06,9.84 226.06,14.6 | 226.06,14.6 226.06,19.37 | 226.06,19.37 226.38,23.81 | 226.38,23.81 225.02,24.03 PD96.4 | 226.38,23.81 227.33,28.26 | 227.33,28.26 225.92,28.71 PD97.4 | 227.33,28.26 228.6,32.7 | 228.6,32.7 227.16,33.26 PD98.4 | 228.6,32.7 230.19,36.83 | 230.19,36.83 228.9,37.43 PD99.4 | 230.19,36.83 230.39,37.21 232.41,40.96 | 232.41,40.96 231.04,41.78 PD100.4 | 232.41,40.96 234.95,45.09 | 234.95,45.09 235.07,45.24 237.81,48.58 | 237.81,48.58 236.49,49.46 PD102.4 | 237.81,48.58 240.98,51.75 | 240.98,51.75 239.75,52.84 PD103.4 | 240.98,51.75 244.47,54.61 | 244.47,54.61 243.38,55.85 PD104.4 | 244.47,54.61 245.91,55.65 246.89,56.37 247.97,57.15 | 247.97,57.15 247.16,58.48 PD105.4 | 247.97,57.15 252.09,59.37 | 252.09,59.37 251.33,60.77 PD106.4 | 252.09,59.37 256.1,61.22 | 256.1,61.22 256.22,61.28 255.69,62.69 PD107.4 | 256.1,61.22 260.35,62.55 | 260.35,62.55 260.08,64 PD108.4 | 260.35,62.55 264.79,63.5 | 264.79,63.5 264.54,65.09 PD109.4 | 264.79,63.5 269.88,63.8 | 269.88,63.8 270.19,63.82 270.19,65.09 PD110.4 | PD9.1 199,120.65 | 199,120.65 200.59,122.24 211.77,122.24 215.98,118.03 PD10.1 219,118.03 220.34,119.38 224.16,119.38 228.68,114.86 PD12.1 237.1,114.86 238.44,116.2 243.52,116.2 | 243.52,116.2 244.47,116.2 247.02,113.66 247.02,112.39 250.27,109.14 PD14.1 252.97,109.22 254.63,109.22 256.22,110.81 259.72,110.81 261.3,109.22 261.3,97.47 264.48,94.3 267.97,94.3 269.71,92.55 | 269.71,92.55 C17.2 269.71,88.43 270.83,87.31 271.07,87.55 PD16.1
  Top 0.508: 16.19,72.07 15.24,71.12 15.24,63.5 | 16.19,72.07 20,72.07 | PD5.1 49.06,97.32 v50.48,98.74 | v64.77,100.33 66.76,100.33 PD7.1 68.5,100.25 68.9,100.65 68.9,112.08 67.63,113.35 66.04,113.35 65.09,114.3 65.09,115.89 65.72,116.52 71.75,116.52 72.39,117.16 73.98,117.16 74.61,117.79 74.61,120.26 75.56,121.21 | 199,120.65 197.48,120.65 196.22,119.38 196.22,114.94 197.28,113.87 C16.2 200.07,112.67 201.29,111.44 214.31,111.44 217.34,108.42 PD11.1 216.46,100.25 214.63,98.42 214.63,95.57 216.22,93.98 227.33,93.98 232.09,89.22 250.51,89.22 251.38,90.09 PD15.1 | PD13.1 235.12,107.78 233.36,109.54 233.36,112.39 233.97,113 241.91,113 242.89,113.98 242.89,115.57 243.52,116.2 | C20.1 206.57,32.9 206.69,33.02 | R12.2 57.67,12.9 58.96,14.2 R27.2 59.05,23.07 59.05,26.03 57.47,27.62 57.47,35.58 R24.2 56.11,38.51 54.61,40.01 54.61,42.86 51.12,46.35 49.85,46.35 47.62,48.58 47.62,49.87 R21.2 47.53,51.21 46.67,52.07 43.52,52.07 R18.2 39.28,57.24 37.78,58.74 32.07,58.74 29.1,61.71 R15.2 26.26,62.64 25.72,63.18 21.27,63.18 20.32,62.23 20.32,61.91 20,61.59 17.46,61.59 17.02,62.04 C22.1 15.41,63.34 15.24,63.5 | 229.01,24.76 R25.2 228.92,15.67 228.92,13.97 230.08,12.81 R28.2 | 229.01,24.76 229.01,28.98 230.82,30.8 230.94,30.68 R22.2 231.55,36.29 234.31,39.05 234.31,40.32 236.11,42.11 R19.2 238.53,47.08 242.89,51.43 245.74,51.43 251.37,57.06 R13.2 258.99,57.06 263.75,61.82 R16.2 275.5,61.82 278.76,65.09 280.35,65.09 280.62,65.36 280.62,66.63 | R31.2 258.88,30.8 244.16,30.8 238.44,25.08 v234.31,25.08 | v231.46,25.08 229.33,25.08 229.01,24.76
  Top 0.508: R32.2 23.61,29.32 23.18,28.89 20.32,28.89 19.37,29.84 19.37,33.97 20.95,35.56 24.76,35.56 25.72,36.51 25.72,51.75 23.18,54.29 20.95,54.29 15.24,60.01 15.24,63.5 | PD73.4 68.32,5.22 69.04,5.22 70.18,6.36 70.18,8.25 | PD94.4 223.31,14.6 226.06,14.6 | PD95.4 226.06,19.37 | 234.95,45.09 PD101.4 | PD26.4 82.23,71.75 | PD23.4 79.69,58.74 | PD22.4 79.38,53.98 | C18.1 79.07,27 82.87,30.8 82.87,32.07 | C19.1 70.18,8.25 | 269.88,63.8 275.07,63.8 C21.1 280.62,66.63 | 280.62,66.63 282.57,68.58 282.57,88.58 277.81,93.34 270.5,93.34 269.71,92.55 | 47.94,90.17 38.73,80.96 21.91,80.96 16.19,75.25 16.19,72.07
  Top 1.016: U5.3 137.79,75.88 137.79,103.19 v135.57,105.41 | v133.03,115.57 133.03,116.84 132.72,117.16 | PD9.1 193.13,126.36 131.76,126.36 130.81,125.41 v128.59,125.41 103.4,125.41 101.04,123.05 101.04,122 91.76,112.71 85.41,112.71 78.74,106.04 78.74,99.06 69.85,90.17 47.94,90.17 45.72,92.39 45.72,94.93 47.23,96.44 PD5.1
  Bottom 0.305: L6.1 120.97,35.24 123.82,38.1 v124.46,38.1 | v169.23,38.1 173.99,42.86 173.99,46.35 | v140.34,106.04 138.43,106.04 137.79,106.68 136.84,106.68 v135.57,105.41 | SJ8.1 244.47,55.88 v245.11,56.51
  Bottom 0.508: v50.48,98.74 63.18,98.74 v64.77,100.33 | v234.31,25.08 v231.46,25.08 | C23.+ 184.47,49.53 183.83,48.9 181.61,48.9 180.02,47.31 180.02,42.23 181.29,40.96 189.23,40.96 189.86,40.32 198.75,40.32 200.98,42.54 200.98,46.35 199.71,47.62 V1.2
  Bottom 1.016: C33.+ 141.92,70.17 141.6,70.48 U5.3 139.06,72.07 138.43,71.44 TP2.TP | C36.2 135.57,66.04 136.84,67.31 141.29,67.31 141.55,67.05 C33.+ | C33.+ 152.34,67.05 154.94,64.45 154.94,60.64 158.75,56.83 158.75,54.29 160.34,52.7 166.05,52.7 169.23,49.53 169.23,47.62 170.5,46.35 173.99,46.35 179.71,52.07 183.83,52.07 184.09,51.81 C23.+ 186.43,51.81 188.64,54.02 C25.2 | v135.57,105.41 133.03,107.95 v133.03,115.57 128.59,120.01 v128.59,125.41
+12V  (via drill 0.35)
  Top 0.305: DISPLAY1.32 206.58,17.98 v208.28,19.68 | v197.8,19.68 191.77,25.72 190.69,25.72 175.89,40.52 v175.89,40.63
  Bottom 0.305: SJ1.2 211.9,23.3 v208.28,19.68 v197.8,19.68 | v175.89,40.63 171.77,36.51 168.59,36.51 167.32,37.78 167.32,49.21 165.99,50.55 L10.1
BL_PWM_1  (via drill 0.35)
  Top 0.305: R8.1 189.22,51.41 R11.1 189.03,63.93 194.63,69.53 194.63,80.01 190.5,84.14 177.48,84.14 173.35,80.01 173.35,45.09 170.5,42.23 v110.81,42.23
  Bottom 0.305: U3.22 109.83,43.2 v110.81,42.23
BL_PWM_2  (via drill 0.35)
  Top 0.305: v109.41,42.1 109.97,41.54 111.09,41.54 111.14,41.59 176.21,41.59 176.85,40.96 176.85,40.64 190.82,26.67 207.65,26.67 213.04,21.27 v213.04,14.29 | v239.71,3.81 R10.1
  Bottom 0.305: U3.23 109.35,42.16 v109.41,42.1 | v213.04,14.29 213.04,11.11 | 213.04,11.11 213.04,7.94 219.39,1.59 237.49,1.59 v239.71,3.81 | R7.1 213.04,11.11
BL_PWM_3  (via drill 0.35)
  Top 0.305: v107.76,41.91 v100.33,41.91 | v76.2,12.06 77.79,12.06 79.38,13.65 94.3,13.65 100.33,19.68 v100.33,38.35 | v59.05,12.38 59.37,12.06 59.37,11.75 59.69,11.43 R9.1
  Bottom 0.305: U3.26 107.82,41.91 v107.76,41.91 | v76.2,12.06 59.37,12.06 v59.05,12.38 48.9,12.38 R6.1 | v100.33,38.35 v100.33,41.91
BOOT0  (via drill 0.35)
  Top 0.305: v100.71,57.79 100.71,60.07 105.41,64.77 106.04,64.77 v107.31,66.04
  Bottom 0.305: U3.60 110.34,54.46 109.85,53.98 104.39,53.98 103.5,54.86 103.5,55.88 101.6,57.79 v100.71,57.79 | v107.31,66.04 SJ6.2
BOOT1  (via drill 0.35)
  Top 0.305: v107.31,37.46 107.31,36.2 107.95,35.56 113.66,35.56 SJ7.2 v114.3,38.1
  Bottom 0.305: U3.28 106.83,42.06 106.68,41.91 106.68,38.73 107.31,38.1 v107.31,37.46 | v114.3,38.1 SJ7.2
CAN_H
  Bottom 0.305: 238.47,74.61 241.34,71.75 U1.7 | R4.2 248.28,71.44 247.17,72.55 | 247.17,72.55 246.13,73.59 243.36,73.59 242.79,73.03 240.98,73.03 239.4,74.61 238.47,74.61 | 238.47,74.61 238.3,74.79 | 247.17,72.55 248.43,73.81 D1.1
  Bottom 1.016: X2.P$1 244.3,80.79 238.3,74.79 X1.P$1
CAN_L
  Bottom 0.305: U1.6 240.07,71.81 238.29,73.59 236.8,73.59 236.23,73.03 234,73.03 233.36,73.66 233.36,77.15 234,77.79 X1.P$2 | X2.P$2 247.33,76.52 251.14,76.52 251.78,75.88 D1.2 252.41,73.17 252.41,69.85 251.78,69.22 R3.2
  Bottom 1.016: X1.P$2 238.12,77.79 240.35,80.01 240.35,83.82 242.57,86.04 246.7,86.04 249.55,83.19 249.55,79.38 247.97,77.79 X2.P$2
CAN_RXD
  Bottom 0.305: U3.44 98.58,51.92 96.52,53.98 96.52,87.95 110.49,101.92 133.67,101.92 139.7,95.88 167.64,95.88 167.96,96.2 177.8,96.2 182.24,91.76 244.16,91.76 255.59,80.33 255.59,57.47 251.46,53.34 239.4,53.34 237.49,55.24 237.49,60.32 238.8,61.63 U1.4
CAN_STB
  Bottom 0.305: U1.8 244.26,68.79 244.8,68.25 R2.2
CAN_TXD
  Bottom 0.305: U3.45 99.02,52.43 97.16,54.29 97.16,87.63 110.81,101.28 133.35,101.28 139.38,95.25 167.96,95.25 168.28,95.57 177.48,95.57 181.93,91.12 243.84,91.12 254.95,80.01 254.95,60.32 252.73,58.1 244.16,58.1 242.61,59.65 U1.1
DATA_WS  (via drill 0.35)
  Top 0.305: v130.81,20.64 128.91,20.64 127.32,19.05 v125.09,19.05
  Bottom 0.305: R56.2 | U7.3 125.08,20.97 R56.2 | v130.81,20.64 131.42,21.25 U6.14 | v125.09,19.05 R56.2
DATA_WS_IN1  (via drill 0.35)
  Top 0.305: v117.79,20 111.44,20 v111.12,20.32 | v21.91,87 20.71,88.19 PD1.4
  Bottom 0.305: U7.4 118.39,20 v117.79,20 | v21.91,87 21.91,81.6 58.42,45.09 58.42,26.99 67.94,17.46 93.34,17.46 96.2,20.32 v111.12,20.32 111.12,19.05 112.08,18.1 116.21,18.1 R57.2
DATA_WS_IN2  (via drill 0.35)
  Top 0.305: PD16.2 268.71,84.35 v267.65,85.41 | v227.97,52.39 221.61,46.04 v221.61,39.37 | v192.72,17.14 183.83,17.14 182.24,15.56 182.24,12.7 180.02,10.48 139.7,10.48 133.98,16.19 130.81,16.19 124.4,9.78 98.68,9.78 v97.47,8.57 | PD17.3 77.15,28.71 v77.15,28.26 | v102.87,21.27 102.87,19.05 98.74,14.92 v97.47,14.92
  Bottom 0.305: v267.65,85.41 261.3,85.41 256.22,80.33 256.22,57.15 251.46,52.39 v227.97,52.39 | v221.61,39.37 221.61,31.43 207.33,17.14 v192.72,17.14 | v77.15,28.26 77.15,19.05 78.1,18.1 93.03,18.1 96.2,21.27 v102.87,21.27 | v97.47,8.57 v97.47,14.92
DATA_WS_IN3  (via drill 0.35)
  Top 0.305: PD72.1 208.09,29.53 v206.06,29.53 | v193.04,29.84 191.13,29.84 v190.82,30.16 | v180.97,28.89 179.71,30.16 177.48,30.16 175.58,28.26 175.58,13.65 173.04,11.11 140.02,11.11 134.3,16.83 130.49,16.83 124.14,10.48 95.25,10.48 93.66,12.06 80.96,12.06 v75.88,6.98 | v72.39,6.35 72.39,5.08 71.44,4.13 66.36,4.13 65.95,4.54 PD73.3
  Bottom 0.305: v206.06,29.53 204.47,27.94 194.94,27.94 v193.04,29.84 | v190.82,30.16 190.5,30.16 189.23,31.43 183.52,31.43 v180.97,28.89 | v75.88,6.98 75.25,6.35 v72.39,6.35
EXT_RX
  Bottom 0.305: U3.43 98.4,51.41 94.23,47.24 94.23,44.7 93.34,43.81 JP4.1
EXT_TX
  Bottom 0.305: JP4.2 93.34,41.27 94.87,42.8 94.87,46.86 98.93,50.93 U3.42
GND  (via drill 0.35, 0.55, 0.65)
  Top 0.305: 149.75,64.98 R71.1 149.86,62.23 151.13,60.96 | 151.13,60.96 151.13,59.55 C45.1 | 151.13,60.96 154.94,60.96 155.89,60.01 155.89,55.24 157.16,53.98 157.16,46.35 155.89,45.09 137.48,45.09 133.03,49.53 133.03,53.02 126,60.05 C13.1 117.84,60.05 115.84,58.05 C14.1 113.4,57.79 v112.08,57.79 | R8.2 195.92,51.41 196.53,50.8 196.53,44.45 195.9,43.81 195.26,43.81 194.94,43.5 | v174.62,92.39 | DISPLAY1.25 201.68,7.62 | 201.68,7.62 200.98,7.62 | 200.98,7.62 DISPLAY1.24 | 200.98,7.62 200.28,7.62 | 200.28,7.62 DISPLAY1.23 | 200.28,7.62 199.58,7.62 | 199.58,7.62 DISPLAY1.22 | 199.58,7.62 198.88,7.62 | 198.88,7.62 DISPLAY1.21 | 198.88,7.62 198.18,7.62 | 198.18,7.62 DISPLAY1.20 | 198.18,7.62 196.08,7.62 | 196.08,7.62 DISPLAY1.17 | 196.08,7.62 195.38,7.62 | 195.38,7.62 DISPLAY1.16 | 195.38,7.62 193.28,7.62 | 193.28,7.62 DISPLAY1.13 | 193.28,7.62 191.88,7.62 | 191.88,7.62 DISPLAY1.11 | 191.88,7.62 191.18,7.62 | 191.18,7.62 DISPLAY1.10 | 191.18,7.62 191.13,7.62 | 191.13,7.62 190.48,7.62 | 190.48,7.62 DISPLAY1.9 | 190.48,7.62 186.98,7.62 | 186.98,7.62 DISPLAY1.4 | 186.98,7.62 186.28,7.62 DISPLAY1.3 | 201.68,7.62 204.15,7.62 | 204.15,7.62 208.91,7.62 213.99,12.7 213.99,21.59 208.91,26.67 208.91,27.32 209.53,27.94 | v204.15,6.35 204.15,7.62 | v191.13,6.35 191.13,7.62 | v249.24,70.8 247.97,72.07 247.65,72.07 | v232.09,53.98 232.78,53.28 232.78,52.97 | JP3.3 130.81,35.24 131.44,35.88 141.6,35.88 142.56,34.92 142.56,30.8 144.46,28.89 v147,28.89 | 129.54,3.17 v129.54,4.76 130.17,5.4 130.17,6.67 132.08,8.57 v132.08,15.24 | v165.1,123.19 164.73,122.82 164.73,122.06 | v114.93,78.42 114.93,79.38 | v96.52,51.75 99.38,51.75 100.65,50.48 100.65,44.13 102.23,42.54 106.3,42.54 107.25,43.5 113.35,43.5 116.84,46.99 116.84,50.48 115.89,51.43 114.62,51.43 113.66,50.48 113.66,48.26 112.71,47.31 v111.44,47.31
  Top 0.305: v53.34,7.62 54.77,7.62 T1.E | v246.7,69.22 245.74,70.17 | 138.43,51.43 138.03,51.84 X6.2 | X6.18 146.03,52.07 | 146.03,52.07 146.03,51.45 146.05,51.43 146.05,52.07 | X6.17 145.53,52.18 145.41,52.07 146.03,52.07 | X6.12 143.03,52.23 142.87,52.07 142.53,52.41 X6.11
  Top 0.406: U4.2 160.02,74.29 158.11,76.2 158.11,79.38 158.75,80.01
  Top 0.508: 17.78,65.09 | 17.78,65.09 17.8,66.65 PD91.2 | 22.86,64.77 22.96,66.27 PD90.2 | 22.86,64.77 27.3,63.82 27.31,63.86 | 27.31,63.86 27.52,65.37 PD89.2 | 27.31,63.86 31.75,62.55 | 31.75,62.55 32.17,64.15 PD88.2 | 31.75,62.55 35.88,60.64 | 35.88,60.64 36.5,62.39 PD87.2 | 35.88,60.64 40,58.74 | 40,58.74 40.68,60.31 PD86.2 | 40,58.74 43.81,56.2 | 43.81,56.2 44.68,57.65 PD85.2 | 43.81,56.2 46.99,53.34 | 46.99,53.34 48.28,54.8 PD84.2 | 46.99,53.34 50.48,50.48 | 50.48,50.48 51.77,51.62 PD83.2 | 50.48,50.48 53.34,46.99 | 53.34,46.99 54.79,47.98 PD82.2 | 53.34,46.99 55.88,43.18 | 55.88,43.18 57.44,44.1 PD81.2 | 55.88,43.18 58.42,39.37 | 58.42,39.37 59.73,39.96 PD80.2 | 58.32,39.52 58.4,39.36 | 58.4,39.36 60.32,35.24 | 60.32,35.24 61.65,35.7 PD79.2 | 60.32,35.24 61.59,30.8 | 61.59,30.8 63.09,31.09 PD78.2 | 58.42,39.37 58.4,39.36 | 61.59,30.8 62.55,26.35 | 62.55,26.35 64.04,26.47 PD77.2 | 62.55,26.35 63.18,21.91 | 63.18,21.91 64.62,21.93 PD76.2 | 63.18,21.91 63.18,17.14 | 63.18,17.14 64.67,16.95 PD75.2 | 63.18,17.14 63.18,12.06 | 63.18,12.06 64.67,12.13 PD74.2 | 73.66,41.27 74.57,36.71 | 74.57,36.71 74.61,36.51 75.88,31.75 76.37,31.9 77.53,32.27 PD17.2 | 73.01,46.61 73.03,46.31 73.66,41.27 | 73.01,46.61 72.71,51.12 | 72.71,51.12 72.71,55.88 | 72.71,55.88 73.04,55.89 PD22.2 | 72.71,55.88 73.02,60.96 | 73.02,60.96 73.66,66.04 | 73.66,66.04 75.53,65.77 PD24.2 | 73.66,66.04 74.93,70.8 | 74.93,70.8 76.54,70.48 PD25.2 | 74.93,70.8 76.2,75.56 | 76.2,75.56 77.89,75.13 PD26.2 | 76.2,75.56 77.79,80.33 | 77.79,80.33 79.39,79.67 PD27.2 | 77.79,80.33 80.01,84.77 | 80.01,84.77 81.54,84.07 PD28.2 | 80.01,84.77 82.04,88.84 | 82.04,88.84 82.23,89.22 83.82,88.35 PD29.2 | 82.04,88.84 84.77,93.34
  Top 0.508: 84.77,93.34 86.36,92.48 PD30.2 | 84.77,93.34 87.63,97.47 | 87.63,97.47 89.06,96.42 | 89.06,96.42 89.15,96.36 | 87.63,97.47 90.8,101.28 | 90.8,101.28 92.21,100.09 PD32.2 | 90.8,101.28 94.3,104.46 | 94.3,104.46 98.11,107.95 | 98.11,107.95 101.92,111.12 | 101.92,111.12 102.91,109.72 PD35.2 | 101.92,111.12 106.04,113.66 | 106.04,113.66 106.83,112.4 PD36.2 | 106.04,113.66 110.17,116.2 110.26,116.06 | 110.26,116.06 111.04,114.82 PD37.2 | 110.26,116.06 114.62,118.43 | 114.62,118.43 115.38,116.98 PD38.2 | 114.62,118.43 119.38,120.33 119.41,120.25 | 119.41,120.25 119.8,118.87 PD39.2 | 119.41,120.25 123.55,121.81 | 123.55,121.81 123.82,121.92 124.39,120.5 PD40.2 | 123.55,121.81 128.59,123.19 | 128.59,123.19 128.98,121.74 PD41.2 | 128.59,123.19 133.67,124.14 | 133.67,124.14 133.81,122.59 PD42.2 | 133.67,124.14 138.39,124.77 | 138.39,124.77 138.43,124.78 | 138.39,124.77 138.65,123.18 PD43.2 | 138.39,124.77 143.19,125.09 | 143.19,125.09 143.35,123.5 PD44.2 | 143.19,125.09 148.27,125.09 | 148.27,125.09 148.18,123.43 PD45.2 | 148.27,125.09 153.35,124.46 | 153.35,124.46 153,122.97 PD46.2 | 153.35,124.46 158.11,123.82 | 158.11,123.82 157.82,122.25 PD47.2 | 158.11,123.82 162.88,122.55 | 162.88,122.55 162.63,121.14 PD48.2 | 162.88,122.55 164.73,122.06 167.64,121.28 | 167.64,121.28 167.18,119.77 PD49.2 | 167.64,121.28 172.4,119.38 | 172.4,119.38 171.72,118.02 PD50.2 | 172.4,119.38 176.85,117.47 | 176.85,117.47 176.31,116.47 | 176.31,116.47 176.12,116.12 | 176.85,117.47 180.97,115.25 | 180.97,115.25 180.27,113.84 PD52.2 | 180.97,115.25 185.1,112.39 | 185.1,112.39 184.41,111.18 PD53.2 | 185.1,112.39 189.23,109.54 | 189.23,109.54 189.08,109.33 188.28,108.26 PD54.2
  Top 0.508: 189.23,109.54 193.04,106.36 | 193.04,106.36 192.02,105.2 PD55.2 | 193.04,106.36 196.53,102.87 | 196.53,102.87 195.49,101.89 PD56.2 | 196.53,102.87 200.03,99.06 | 200.03,99.06 198.7,98.19 PD57.2 | 200.03,99.06 202.88,95.25 | 202.88,95.25 201.64,94.49 PD58.2 | 202.88,95.25 205.74,91.12 | 205.74,91.12 204.45,90.41 PD59.2 | 205.74,91.12 208.28,87 | 208.28,87 206.87,86.24 PD60.2 | 208.28,87 210.5,82.55 | 210.5,82.55 209.03,81.94 PD61.2 | 210.5,82.55 212.41,77.79 | 212.41,77.79 210.92,77.32 PD62.2 | 212.41,77.79 213.99,73.03 | 213.99,73.03 212.29,72.73 PD63.2 | 213.99,73.03 214.26,71.68 214.95,68.26 214.89,68.25 | 214.89,68.25 213.53,68.02 PD64.2 | 214.89,68.25 215.9,63.5 215.86,63.49 | 215.86,63.49 214.38,63.3 PD65.2 | 215.86,63.49 216.53,58.74 | 216.53,58.74 214.97,58.51 PD66.2 | 216.53,58.74 216.85,53.66 | 216.85,53.66 215.17,53.67 PD67.2 | 216.85,53.66 216.85,53.64 216.53,48.58 | 216.53,48.58 214.96,48.82 PD68.2 | 216.53,48.58 216.22,43.81 | 216.22,43.81 214.52,44.15 PD69.2 | 216.22,43.81 215.58,38.73 | 215.58,38.73 213.8,39.08 PD70.2 | 215.58,38.73 214.31,33.97 | 214.31,33.97 212.72,28.89 212.54,28.96 212.44,28.99 211.21,29.42 211.06,29.47 210.65,29.06 210.5,29.23 PD72.2 | 219.39,6.98 220.88,7.05 222.1,7.05 PD92.2 | 219.39,6.98 219.39,11.75 | 219.39,11.75 220.88,11.87 PD93.2 | 219.39,11.75 219.39,16.51 | 219.39,16.51 219.39,21.59 | 219.39,21.59 221.08,21.52 PD95.2 | 220.03,26.67 220.02,26.63 | 220.02,26.63 219.39,21.59 | 220.03,26.67 220.3,26.64 221.67,26.47 PD96.2 | 220.03,26.67 221.3,31.75 | 221.3,31.75 222.8,31.43 PD97.2 | 221.3,31.75 222.88,36.83 | 222.88,36.83 224.34,36.29 PD98.2 | 224.79,41.27 224.92,41.52 | 224.92,41.52 227.33,46.04